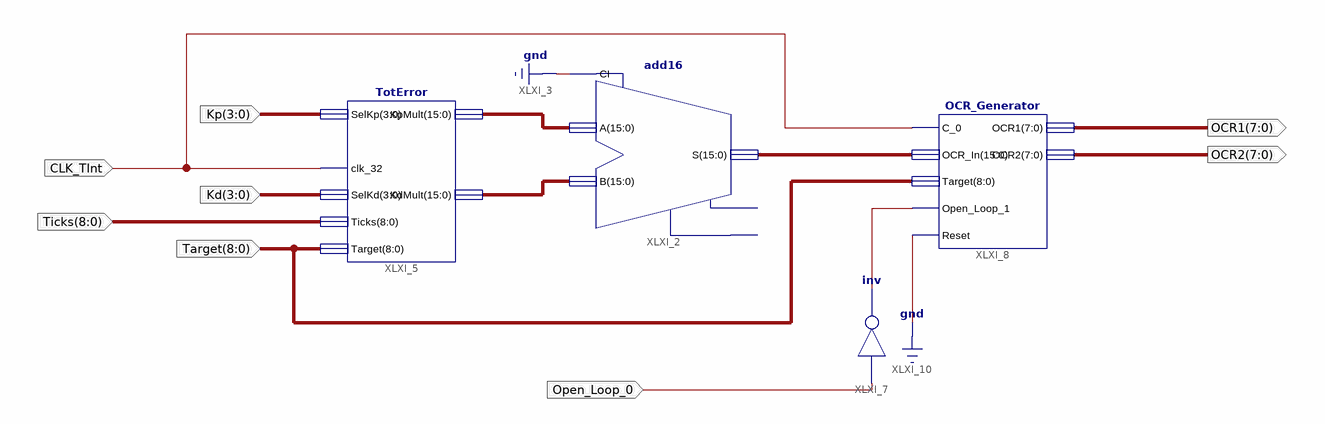
[diagram p0: schematic sheet 1]
// Xilinx ISE schematic PID_Module.sch (spartan3e) as structural Verilog: 4 symbols, 8 ports
module PID_Module (
  input  [3:0] Kp,
  input  CLK_TInt,
  input  [3:0] Kd,
  input  [8:0] Ticks,
  input  [8:0] Target,
  input  Open_Loop_0,
  output [7:0] OCR1,
  output [7:0] OCR2
);

  wire XLXN_18;
  wire [15:0] XLXN_6, XLXN_7, XLXN_17;

  add16 XLXI_2 (.A(XLXN_6), .B(XLXN_7), .CI(1'b0), .S(XLXN_17));  // open: CO, OFL
  TotError XLXI_5 (
    .SelKp(Kp), .clk_32(CLK_TInt), .SelKd(Kd), .KpMult(XLXN_6), .KdMult(XLXN_7), .Ticks(Ticks),
    .Target(Target));
  not XLXI_7 (XLXN_18, Open_Loop_0);
  OCR_Generator XLXI_8 (
    .C_0(CLK_TInt), .OCR_In(XLXN_17), .Target(Target), .Open_Loop_1(XLXN_18), .Reset(1'b0), .OCR1(OCR1),
    .OCR2(OCR2));
endmodule
